# EAGLE schematic TPDH-Walrus_v2_NoConn (EAGLE 9.4.2)
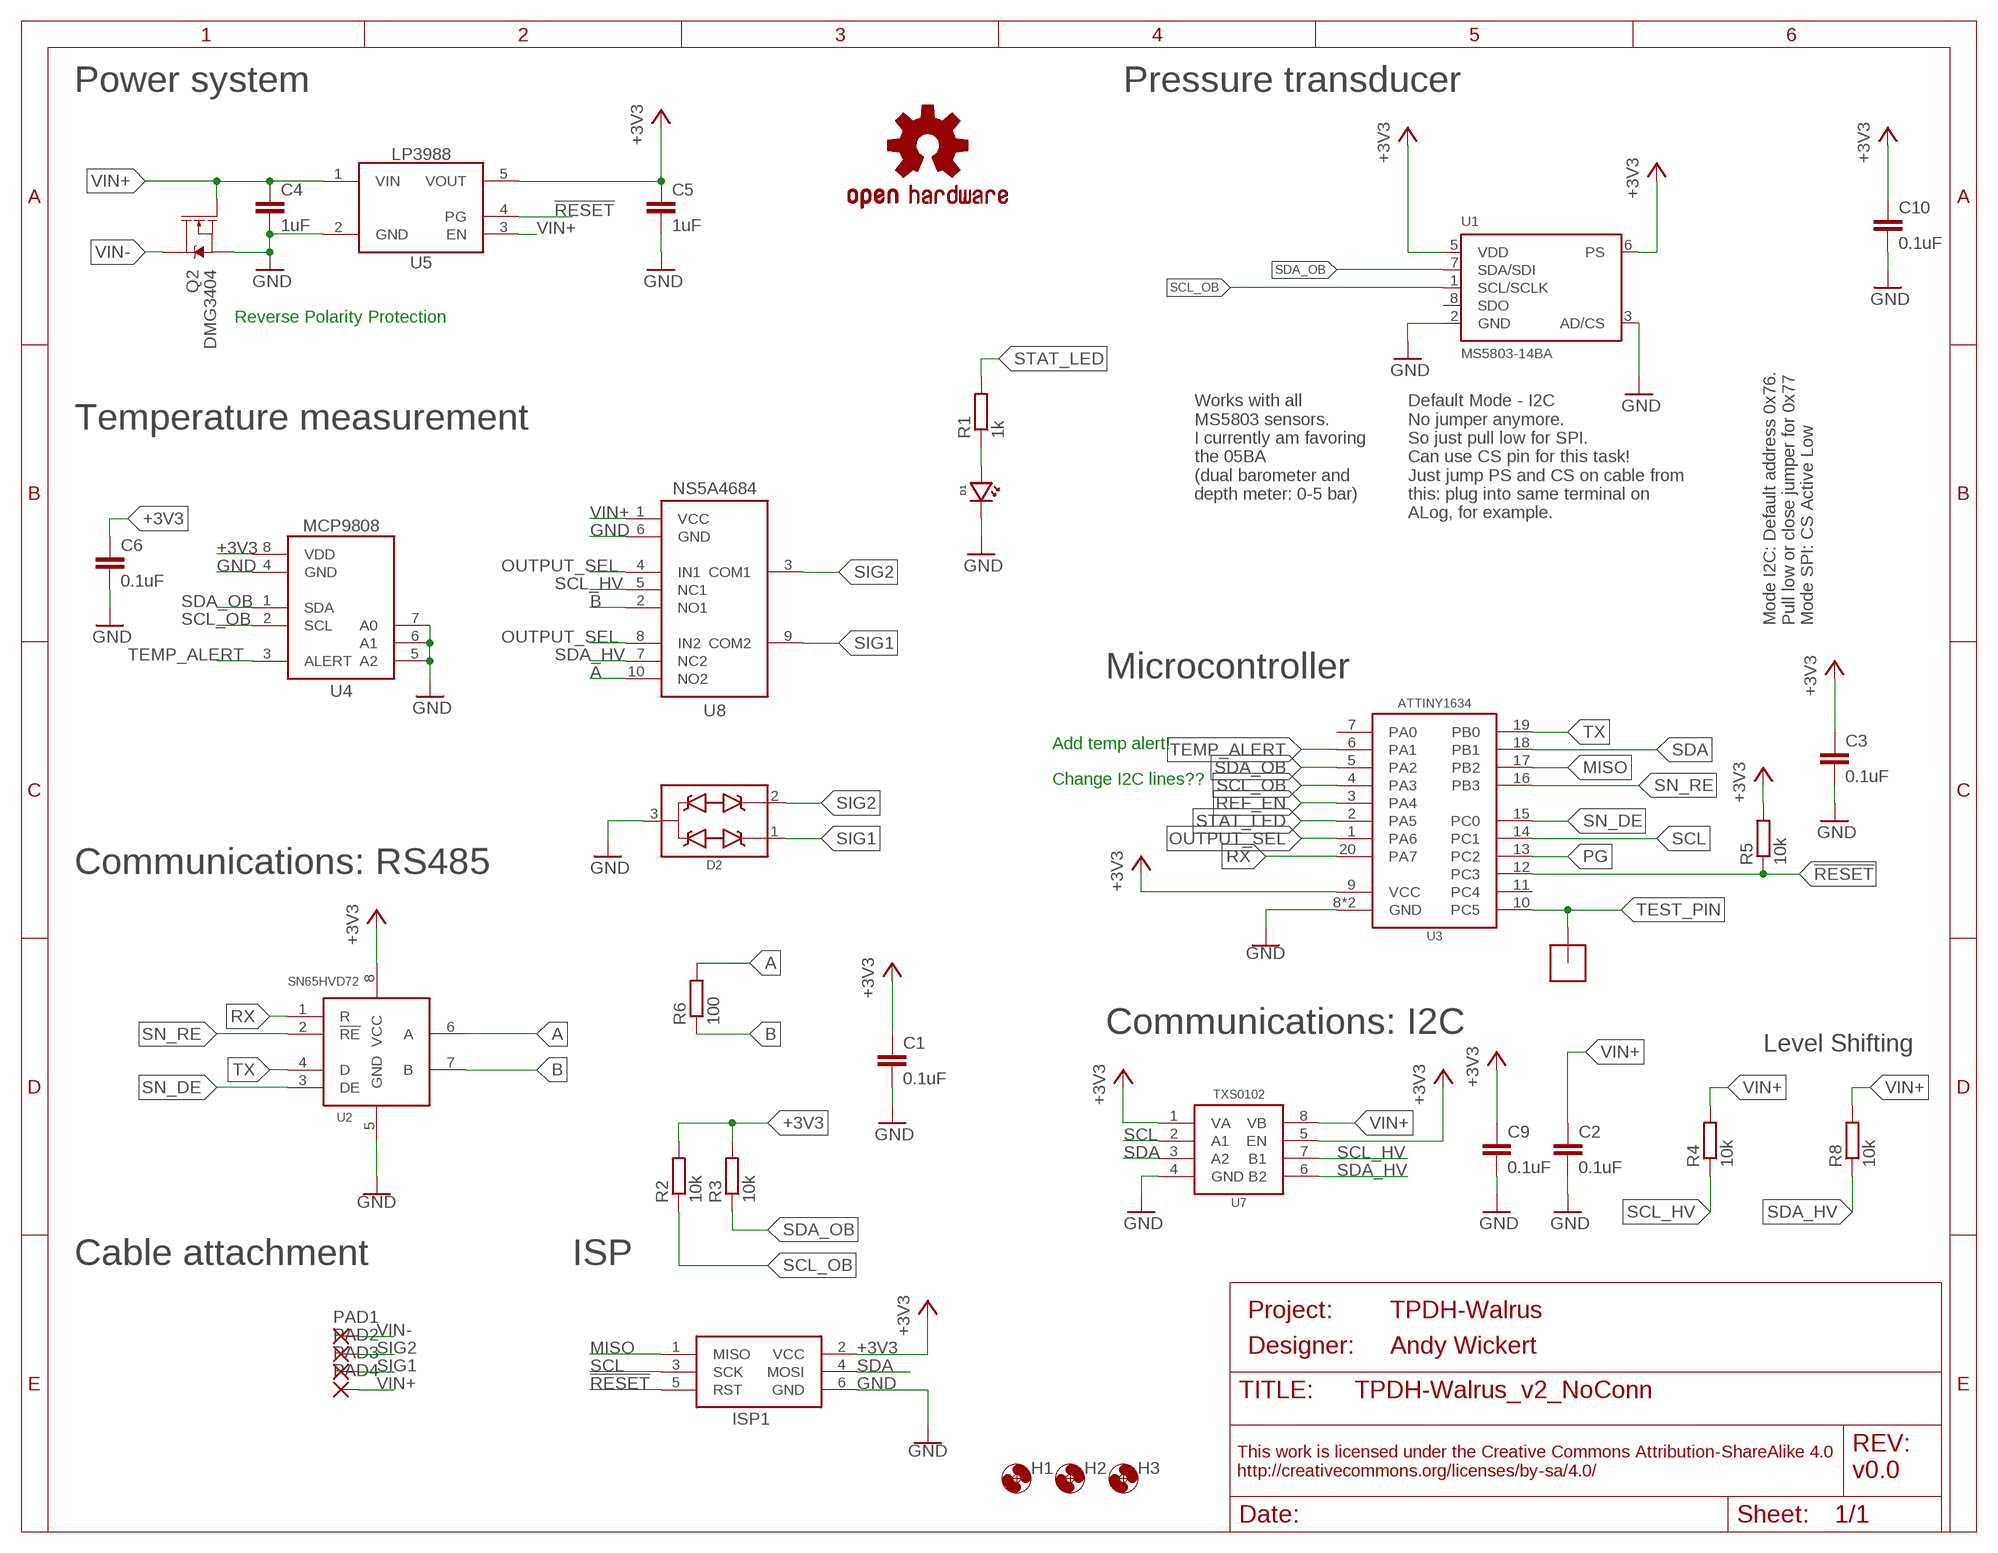
[diagram p0: schematic, sheet 1]
FRAME1 (FRAME_A_L): DESIGNER: Andy Wickert; PROJECT: TPDH-Walrus; REV: v0.0

## Parts
C1  0.1uF  C-EU0.1UFC0402  [C0402]
C2  0.1uF  C-EU0.1UFC0402  [C0402]
C3  0.1uF  C-EU0.1UFC0402  [C0402]
C4  1uF  C-EU1UFC0603  [C0603]
C5  1uF  C-EU1UFC0603  [C0603]
C6  0.1uF  C-EU0.1UFC0402  [C0402]
C9  0.1uF  C-EU0.1UFC0402  [C0402]
C10  0.1uF  C-EU0.1UFC0402  [C0402]
D1  LEDBLUE0603  [LED_0603]
D2  TVSSM712  [SOT23-3]
H1  MOUNTING_HOLE2_NP  [2_56]
H2  MOUNTING_HOLE2_NP  [2_56]
H3  MOUNTING_HOLE2_NP  [2_56]
ISP1  AVRISP-6  [AVRISP]
LOGO1  OSHW-LOGOM  [OSHW-LOGO-M]
PAD1  PAD1.1MM  [2,54/1,1]
PAD2  PAD1.1MM  [2,54/1,1]
PAD3  PAD1.1MM  [2,54/1,1]
PAD4  PAD1.1MM  [2,54/1,1]
Q2  DMG3404  MOSFET-NCH-DMG3404L  [SOT23-3]
R1  1k  R-EU_1KR0603  [R0603]
R2  10k  R-EU_10KR0402  [R0402]
R3  10k  R-EU_10KR0402  [R0402]
R4  10k  R-EU_10KR0402  [R0402]
R5  10k  R-EU_10KR0402  [R0402]
R6  100  R-EU_100R0402  [R0402]
R8  10k  R-EU_10KR0402  [R0402]
U1  MS5803-14BA  [MS5803]
U2  SN65HVD72DSOIC  [SO08]
U3  ATTINY1634QFN  [QFN20]
U4  MCP9808MSOP  [MSOP_8]
U5  LP39883.3VDBV  [DBV0005A]
U7  TXS0102DQM  [DQM_R-PX2SON-N8]
U8  NS5A4684S  [WQFN10]
U$12  POGO_PAD  [POGO_PAD]

## Nets
!RESET: ISP1.5(RST) R5.1 U3.12(PC3) U5.4(PG)
+3V3: C1.1 C3.1 C5.1 C6.1 C9.1 C10.1 ISP1.2(VCC) R2.2 R3.2 R5.2 U1.5(VDD) U1.6(PS) U2.8(VCC) U3.9(VCC) U4.8(VDD) U5.5(VOUT) U7.1(VA) U7.5(EN)
A: R6.2 U2.6(A) U8.10(NO2)
B: R6.1 U2.7(B) U8.2(NO1)
GND: C1.2 C2.2 C3.2 C4.2 C5.2 C6.2 C9.2 C10.2 D1.CATHODE D2.3(COM) ISP1.6(GND) Q2.2(S) U1.2(GND) U1.3(AD/CS) U2.5(GND) U3.8(GND) U3.EP(GND) U4.4(GND) U4.5(A2) U4.6(A1) U4.7(A0) U5.2(GND) U7.4(GND) U8.6(GND)
MISO: ISP1.1(MISO) U3.17(PB2)
N$2: D1.ANODE R1.1
OUTPUT_SEL: U3.1(PA6) U8.4(IN1) U8.8(IN2)
PG: U3.13(PC2)
REF_EN: U3.3(PA4)
RX: U2.1(R) U3.20(PA7)
SCL: ISP1.3(SCK) U3.14(PC1) U7.2(A1)
SCL_HV: R4.1 U7.7(B1) U8.5(NC1)
SCL_OB: R2.1 U1.1(SCL/SCLK) U3.4(PA3) U4.2(SCL)
SDA: ISP1.4(MOSI) U3.18(PB1) U7.3(A2)
SDA_HV: R8.1 U7.6(B2) U8.7(NC2)
SDA_OB: R3.1 U1.7(SDA/SDI) U3.5(PA2) U4.1(SDA)
SIG1: D2.1(D1) PAD3.1(P) U8.9(COM2)
SIG2: D2.2(D2) PAD2.1(P) U8.3(COM1)
SN_DE: U2.3(DE) U3.15(PC0)
SN_RE: U2.2(!RE) U3.16(PB3)
STAT_LED: R1.2 U3.2(PA5)
TEMP_ALERT: U3.6(PA1) U4.3(ALERT)
TEST_PIN: U3.10(PC5) U$12.P$1
TX: U2.4(D) U3.19(PB0)
VIN+: C2.1 C4.1 PAD4.1(P) Q2.1(G) R4.2 R8.2 U5.1(VIN) U5.3(EN) U7.8(VB) U8.1(VCC)
VIN-: PAD1.1(P) Q2.3(D)
Unconnected: U1.8(SDO) U3.7(PA0) U3.11(PC4)

## Notes on the sheet
- Power system | Pressure transducer
- Reverse Polarity Protection
- Works with all
  MS5803 sensors.
  I currently am favoring
  the 05BA
  (dual barometer and
  depth meter: 0-5 bar)
- Default Mode - I2C
  No jumper anymore.
  So just pull low for SPI.
  Can use CS pin for this task!
  Just jump PS and CS on cable from
  this: plug into same terminal on
  ALog, for example.
- Temperature measurement
- Mode I2C: Default address 0x76.
  Pull low or close jumper for 0x77
  Mode SPI: CS Active Low
- Microcontroller
- Add temp alert!
- Change I2C lines??
- Communications: RS485
- Communications: I2C
- Level Shifting
- Cable attachment | ISP

## Library data of the parts
C1-C3 C6 C9 C10 = bschulz_passives:C-EU: CAPACITOR, European symbol; DIGIKEY: 490-4759-1-ND; MF: Murata; MPN: GCM155R71C104KA55D
C4 C5 = bschulz:C-EU: CAPACITOR, European symbol; DIGIKEY: 1276-6524-1-ND; MF: Samsung; MPN: 1276-6524-1-ND
D1 = bschulz:LED: Genaric LED; DIGIKEY: 732-4966-1-ND; MF: Wurth; MPN: 150060BS75000
D2 = bschulz:TVS: Generic dual channel TVS diode; DIGIKEY: CDSOT23-SM712CT-ND; MF: Bourns; MPN: CDSOT23-SM712
H1-H3 = bschulz:MOUNTING_HOLE: Genaric Mechanical Mounting Hole Hole diameter based on max body diameter + 15% Keepout ring is for diameter of socket cap screw (minimum required clearance) TPlace ring is for diameter of pan head screw (recomended clearance) Specifications: Socket Cap <http://fastener-express.com/fastener-technical/SocketscapSS-Alloy.pdf> Button Head Socket Cap <http://fastener-express.com/fastener-technical/Button-Socket-alloy.pdf> Pan Head <http://fastener-express.com/fastener-technical/pan-machine-Screws.pdf>
ISP1 = bschulz:AVRISP: AVR ISP HEADER Standard 6 pin header for AVR programming
LOGO1 = SparkFun-Aesthetics:OSHW-LOGO: Open-Source Hardware (OSHW) Logo This logo indicates the piece of hardware it is found on incorporates a OSHW license and/or adheres to the definition of open source hardware found here: http://freedomdefined.org/OSHW
PAD1-PAD4 = bschulz:PAD: THROUGH-HOLE PAD
Q2 = bschulz:MOSFET-NCH: N-channel MOSFETs Voltage controlled devices that allow control of high current outputs. SparkFun Products: SparkFun OpenScale <https://www.sparkfun.com/products/13261> SparkFun Digital Sandbox <https://www.sparkfun.com/products/12651> SparkFun Monster Moto Shield <https://www.sparkfun.com/products/10182> SparkFun MOSFET Power Controller <https://www.sparkfun.com/products/11214>; DIGIKEY: DMG3404L-7DICT-ND; MF: Diodes Incorporated; MPN: DMG3404L-7
R1 = bschulz_passives:R-EU_: RESISTOR, European symbol Digikey Parts: Yageo, 0402 <https://www.digikey.com/products/en/resistors/chip-resistor-surface-mount/52?k=&pkeyword=&sf=0&FV=ffec1104%2Cfffc000d%2C1c0002%2C440067%2C1f140000%2Cffe00034%2C400004&quantity=&ColumnSort=0&page=1&stock=1&pageSize=25> Yageo, 0603 <https://www.digikey.com/products/en/resistors/chip-resistor-surface-mount/52?k=&pkeyword=&s=4356&s=47360&sf=0&FV=fffc000d%2C1c0002%2C142c040c%2C1f140000%2Cffe00034&quantity=10&ColumnSort=1000011&page=1&stock=1&pageSize=25> Panasonic, 0603 <https://www.digikey.com/products/en/resistors/chip-resistor-surface-mount/52?k=&pkeyword=&pv252=68&sf=0&FV=ffec373d%2C1c0002%2C142c040c%2C1f140000%2Cffe00034%2C80002%2Cc0001&quantity=&ColumnSort=0&page=1&stock=1&pageSize=25> Panasonic, precision, 0603 <https://www.digikey.com/products/en/resistors/chip-resistor-surface-mount/52?FV=ffec4907%2Cfffc000a%2Cc0172%2C142c040c%2C1f140000%2Cffe00034%2C1c0002&quantity=100&ColumnSort=2085&page=1&stock=1&pageSize=25> Panasonic, 0805 <https://www.digikey.com/products/en/resistors/chip-resistor-surface-mount/52?k=&pkeyword=&pv3=1&sf=0&FV=ffec373d%2C1c0002%2C1f140000%2Cffe00034%2C142c040d&quantity=&ColumnSort=0&page=1&stock=1&pageSize=25> Rohm, current sense <https://www.digikey.com/products/en/resistors/chip-resistor-surface-mount/52?k=&pkeyword=&pv3=1&sf=0&FV=ffecb688%2C1f140000%2Cffe00034%2C1c0002&quantity=&ColumnSort=0&page=1&stock=1&pageSize=25> Vishay, pulse proof automotive <https://www.digikey.com/products/en/resistors/chip-resistor-surface-mount/52?k=&pkeyword=&pv7=2&sf=0&FV=ffec5d6b%2Cffe00034%2C1f140000&quantity=&ColumnSort=0&page=1&stock=1&pageSize=25>; DIGIKEY: 311-1KLDCT-ND; MF: Yageo; MPN: AC0603FR-071KL; VALUE_PART: 1k
R2-R5 R8 = bschulz_passives:R-EU_: RESISTOR, European symbol Digikey Parts: Yageo, 0402 <https://www.digikey.com/products/en/resistors/chip-resistor-surface-mount/52?k=&pkeyword=&sf=0&FV=ffec1104%2Cfffc000d%2C1c0002%2C440067%2C1f140000%2Cffe00034%2C400004&quantity=&ColumnSort=0&page=1&stock=1&pageSize=25> Yageo, 0603 <https://www.digikey.com/products/en/resistors/chip-resistor-surface-mount/52?k=&pkeyword=&s=4356&s=47360&sf=0&FV=fffc000d%2C1c0002%2C142c040c%2C1f140000%2Cffe00034&quantity=10&ColumnSort=1000011&page=1&stock=1&pageSize=25> Panasonic, 0603 <https://www.digikey.com/products/en/resistors/chip-resistor-surface-mount/52?k=&pkeyword=&pv252=68&sf=0&FV=ffec373d%2C1c0002%2C142c040c%2C1f140000%2Cffe00034%2C80002%2Cc0001&quantity=&ColumnSort=0&page=1&stock=1&pageSize=25> Panasonic, precision, 0603 <https://www.digikey.com/products/en/resistors/chip-resistor-surface-mount/52?FV=ffec4907%2Cfffc000a%2Cc0172%2C142c040c%2C1f140000%2Cffe00034%2C1c0002&quantity=100&ColumnSort=2085&page=1&stock=1&pageSize=25> Panasonic, 0805 <https://www.digikey.com/products/en/resistors/chip-resistor-surface-mount/52?k=&pkeyword=&pv3=1&sf=0&FV=ffec373d%2C1c0002%2C1f140000%2Cffe00034%2C142c040d&quantity=&ColumnSort=0&page=1&stock=1&pageSize=25> Rohm, current sense <https://www.digikey.com/products/en/resistors/chip-resistor-surface-mount/52?k=&pkeyword=&pv3=1&sf=0&FV=ffecb688%2C1f140000%2Cffe00034%2C1c0002&quantity=&ColumnSort=0&page=1&stock=1&pageSize=25> Vishay, pulse proof automotive <https://www.digikey.com/products/en/resistors/chip-resistor-surface-mount/52?k=&pkeyword=&pv7=2&sf=0&FV=ffec5d6b%2Cffe00034%2C1f140000&quantity=&ColumnSort=0&page=1&stock=1&pageSize=25>; DIGIKEY: 311-10.0KLRCT-ND; MF: Yageo; MPN: RC0402FR-0710KL; VALUE_PART: 10k
R6 = bschulz_passives:R-EU_: RESISTOR, European symbol Digikey Parts: Yageo, 0402 <https://www.digikey.com/products/en/resistors/chip-resistor-surface-mount/52?k=&pkeyword=&sf=0&FV=ffec1104%2Cfffc000d%2C1c0002%2C440067%2C1f140000%2Cffe00034%2C400004&quantity=&ColumnSort=0&page=1&stock=1&pageSize=25> Yageo, 0603 <https://www.digikey.com/products/en/resistors/chip-resistor-surface-mount/52?k=&pkeyword=&s=4356&s=47360&sf=0&FV=fffc000d%2C1c0002%2C142c040c%2C1f140000%2Cffe00034&quantity=10&ColumnSort=1000011&page=1&stock=1&pageSize=25> Panasonic, 0603 <https://www.digikey.com/products/en/resistors/chip-resistor-surface-mount/52?k=&pkeyword=&pv252=68&sf=0&FV=ffec373d%2C1c0002%2C142c040c%2C1f140000%2Cffe00034%2C80002%2Cc0001&quantity=&ColumnSort=0&page=1&stock=1&pageSize=25> Panasonic, precision, 0603 <https://www.digikey.com/products/en/resistors/chip-resistor-surface-mount/52?FV=ffec4907%2Cfffc000a%2Cc0172%2C142c040c%2C1f140000%2Cffe00034%2C1c0002&quantity=100&ColumnSort=2085&page=1&stock=1&pageSize=25> Panasonic, 0805 <https://www.digikey.com/products/en/resistors/chip-resistor-surface-mount/52?k=&pkeyword=&pv3=1&sf=0&FV=ffec373d%2C1c0002%2C1f140000%2Cffe00034%2C142c040d&quantity=&ColumnSort=0&page=1&stock=1&pageSize=25> Rohm, current sense <https://www.digikey.com/products/en/resistors/chip-resistor-surface-mount/52?k=&pkeyword=&pv3=1&sf=0&FV=ffecb688%2C1f140000%2Cffe00034%2C1c0002&quantity=&ColumnSort=0&page=1&stock=1&pageSize=25> Vishay, pulse proof automotive <https://www.digikey.com/products/en/resistors/chip-resistor-surface-mount/52?k=&pkeyword=&pv7=2&sf=0&FV=ffec5d6b%2Cffe00034%2C1f140000&quantity=&ColumnSort=0&page=1&stock=1&pageSize=25>; DIGIKEY: 311-100LRCT-ND; MF: Yageo; MPN: RC0402FR-07100RL; VALUE_PART: 100
U1 = MS5803:MS5803-14BA; DIGIKEY: 223-1625-5-ND; MF: TE; MPN: MS580305BA01-00; PROD_ID: IC-12111
U2 = bschulz:SN65HVD72: SN65HVD72 - Half Duplex RS-485 Tranciver, with output enable Characteristics: VCC: 3~3.6V Operating Temperature: -40°C to 125°C Digikey: 296-39179-1-ND (D) <https://www.digikey.com/product-detail/en/texas-instruments/SN65HVD72DR/296-39179-1-ND/5143186>; DIGIKEY: 296-39179-1-ND; DISP: SN65HVD72; MF: TI; MPN: SN65HVD72DR
U3 = bschulz:ATTINY1634: ATtiny1634 8 bit AVR Microcontroller Features: Vcc: 1.8 ~ 5.5V Clock: Up to 16MHz, Internal 8MHz FRC, 32kHz RC Flash Memory: 16K SRAM: 1K EEPROM: 256B ADC: 10b, 12 port USART: Yes, x2 SPI: Yes I2C: Yes, slave only Notes: 2 analog comp. Digikey: ATTINY1634R-MURCT-ND (QFN) <https://www.digikey.com/product-detail/en/microchip-technology/ATTINY1634R-MUR/ATTINY1634R-MURCT-ND/3440781> ATTINY1634R-SU-ND (SOIC) <https://www.digikey.com/product-detail/en/ATTINY1634R-SU/ATTINY1634R-SU-ND/3128699/?itemSeq=272981030>; DIGIKEY: ATTINY1634-MURCT-ND; MF: Atmel; MPN: ATTINY1634-MUR
U4 = bschulz:MCP9808: MCP9808 - Digital Temperature Sensor Characteristics: VCC: 2.7~5.5V Operating Temperature: -40°C to 125°C Accuracy: ±0.25°C (-40 to +125°C) IQ: 200μA (0.1μA Shutdown) Resolution: 0.0625°C Digikey: MCP9808T-E/MSCT-ND (MSOP) <https://www.digikey.com/product-detail/en/microchip-technology/MCP9808T-E-MS/MCP9808T-E-MSCT-ND/5169548> MCP9808T-E/MCCT-ND (DFN) <https://www.digikey.com/product-detail/en/microchip-technology/MCP9808T-E-MC/MCP9808T-E-MCCT-ND/2802117>; DIGIKEY: MCP9808T-E/MSCT-ND; MF: Microchip; MPN: MCP9808T-E/MS
U5 = bschulz:LP3988: TPS7A05* - Ultra Low Power Ultra Low Dropout Linear Regulator with Power Good Characteristics: Vin: 2.5V ~ 6V Vout: 1.8, 2.5, 2.85, 3.3V fixed IQ: 85μA typ, 200μA max Voltage Accuracy: 2% typ, 3.5% max Output Current: 150 mA Operating Temperature: -40°C to 125°C Digikey: LP3988IMF-3.3/NOPBCT-ND (3.3V Fixed) <https://www.digikey.com/products/en/integrated-circuits-ics/pmic-voltage-regulators-linear/699?k=LP3988&k=&pkeyword=LP3988&sv=0&pv1779=50&sf=0&FV=1c0002%2Cffe002bb%2C1f140000&quantity=&ColumnSort=0&page=1&pageSize=25>; DIGIKEY: LP3988IMF-3.3/NOPBCT-ND; MF: TI; MPN: LP3988IMF-3.3/NOPB
U7 = bschulz:TXS0102: TXS0102 - 2 Channel Bidirectional Voltage Level Translator Characteristics: Vcc: 1.65 ~ 3.6V (Port A), 2.3 ~ 5.5V (Port B) IQ: 14.4μA Output Current: 50mA Output Type: Open Drain/Push-Pull Operating Temperature: -40°C to 85°C Digikey: 296-28368-1-ND (DQE) <https://www.digikey.com/product-detail/en/texas-instruments/TXS0102DQER/296-28368-1-ND/2625893> 296-28435-1-ND (DQM) <https://www.digikey.com/product-detail/en/texas-instruments/TXS0102DQMR/296-28435-1-ND/2638910> 296-21931-1-ND (DCU) <https://www.digikey.com/product-detail/en/texas-instruments/TXS0102DCUR/296-21931-1-ND/1629284>; DIGIKEY: 296-28435-1-ND; MF: TI; MPN: TXS0102DQMR
U8 = bschulz:NS5A4684S: NS5A4684S - Dual Analog Multiplexer (1:2) Characteristics: VCC: 1.65~5.5V Operating Temperature: -40°C to 85°C Digikey: NS5A4684SMNTAGOSCT-ND (10-WFQFN) <https://www.digikey.com/product-detail/en/on-semiconductor/NS5A4684SMNTAG/NS5A4684SMNTAGOSCT-ND/9087458>; DIGIKEY: NS5A4684SMNTAGOSCT-ND; DISP: NS5A4684; MF: ON Semiconductor; MPN: NS5A4684SMNTAG
U$12 = bschulz:POGO_PAD: POGO Pad SMD pad for interfacing with POGO Pins